# EAGLE schematic paneControl (EAGLE 6.5.0)
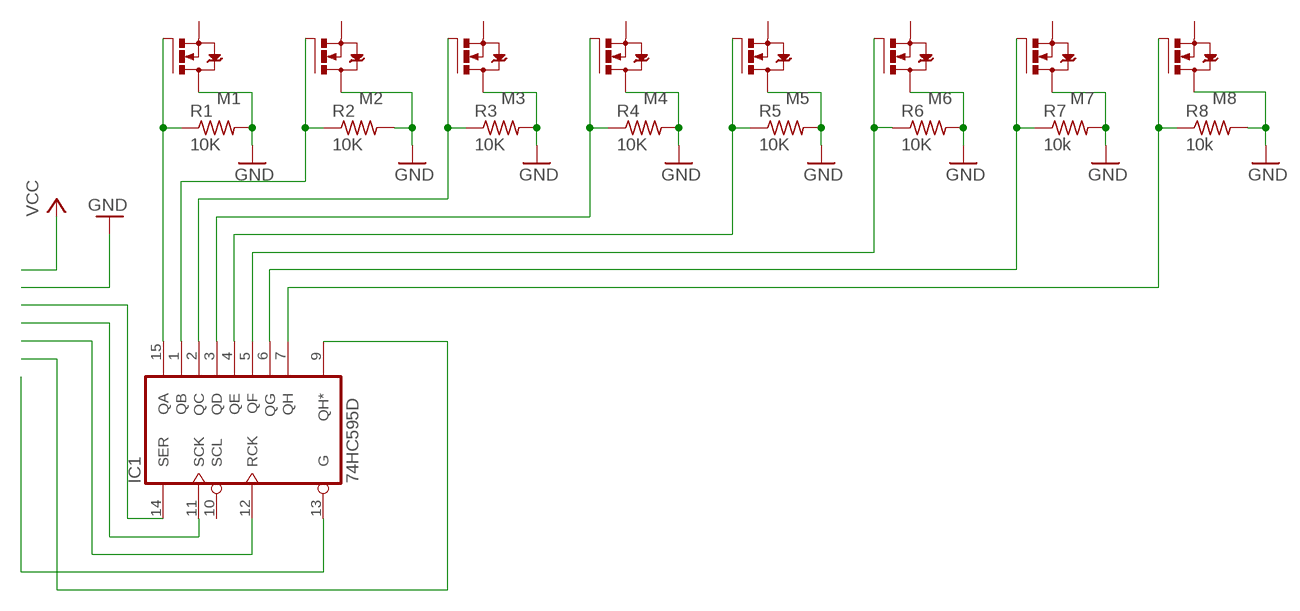
[diagram p0: schematic, sheet 1]

## Parts
IC1  74HC595D  [SO16]
M1  2N7000  [TO92D-]
M2  2N7000  [TO92D-]
M3  2N7000  [TO92D-]
M4  2N7000  [TO92D-]
M5  2N7000  [TO92D-]
M6  2N7000  [TO92D-]
M7  2N7000  [TO92D-]
M8  2N7000  [TO92D-]
R1  10K  R-US_R0603  [R0603]
R2  10K  R-US_R0603  [R0603]
R3  10K  R-US_R0603  [R0603]
R4  10K  R-US_R0603  [R0603]
R5  10K  R-US_R0603  [R0603]
R6  10K  R-US_R0603  [R0603]
R7  10k  R-US_R0603  [R0603]
R8  10k  R-US_R0603  [R0603]

## Nets
GND: M1.3(D) M2.3(D) M3.3(D) M4.3(D) M5.3(D) M6.3(D) M7.3(D) M8.3(D) R1.2 R2.2 R3.2 R4.2 R5.2 R6.2 R7.2 R8.2
HIGH: IC1.9(QH*)
N$10: IC1.7(QH) M8.2(G) R8.1
N$11: IC1.15(QA) M1.2(G) R1.1
N$12: IC1.1(QB) M2.2(G) R2.1
N$13: IC1.2(QC) M3.2(G) R3.1
N$14: IC1.3(QD) M4.2(G) R4.1
N$15: IC1.4(QE) M5.2(G) R5.1
N$16: IC1.5(QF) M6.2(G) R6.1
N$17: IC1.13(G)
N$18: IC1.6(QG) M7.2(G) R7.1
N$21: IC1.14(SER)
N$22: IC1.11(SCK)
N$23: IC1.12(RCK)
Unconnected: IC1.10(SCL) M1.1(S) M2.1(S) M3.1(S) M4.1(S) M5.1(S) M6.1(S) M7.1(S) M8.1(S)

## Power pins joined to a net without a drawn wire
GND: IC1.8(GND)
VCC: IC1.16(VCC)

## Library data of the parts
IC1 = 74xx-eu:74*595: 8-bit SHIFT REGISTER, output latch; OC_NEWARK: unknown
M1-M8 = ads4:2N7000: 2N7000 N-Channel Logic-Level MOSFET; OC_NEWARK: unknown
R1-R8 = resistor:R-US_: RESISTOR, American symbol; OC_NEWARK: unknown

## Net classes
0 default: width 0.381 mm, drill 0.508 mm, clearance 0.254 mm